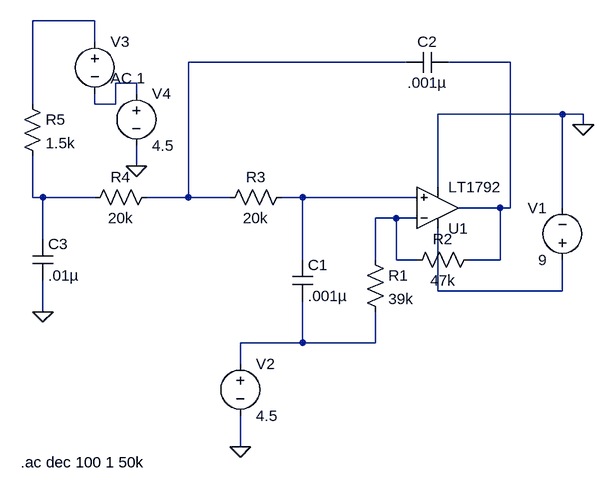
[diagram p0: schematic LPFmodified.asc]
LPFmodified.asc, the LTspice schematic file:
Version 4
SHEET 1 880 680
WIRE -368 -176 -464 -176
WIRE -368 -144 -368 -176
WIRE 112 -112 -224 -112
WIRE 272 -112 176 -112
WIRE -304 -80 -336 -80
WIRE -304 -64 -304 -80
WIRE -464 -48 -464 -176
WIRE -368 -48 -368 -64
WIRE -336 -48 -336 -80
WIRE -336 -48 -368 -48
WIRE 352 -32 160 -32
WIRE 384 -32 352 -32
WIRE 384 -16 384 -32
WIRE -304 48 -304 16
WIRE 160 80 160 -32
WIRE -464 96 -464 32
WIRE -448 96 -464 96
WIRE -416 96 -448 96
WIRE -368 96 -416 96
WIRE -224 96 -224 -112
WIRE -224 96 -288 96
WIRE -160 96 -224 96
WIRE -48 96 -80 96
WIRE 128 96 -48 96
WIRE 256 112 192 112
WIRE 272 112 272 -112
WIRE 272 112 256 112
WIRE 352 112 352 -32
WIRE 96 128 64 128
WIRE 128 128 96 128
WIRE -448 160 -448 96
WIRE -48 192 -48 96
WIRE 64 192 64 128
WIRE 96 192 96 128
WIRE 128 192 96 192
WIRE 256 192 256 112
WIRE 256 192 208 192
WIRE 160 240 160 144
WIRE 352 240 352 192
WIRE 352 240 160 240
WIRE -448 272 -448 224
WIRE -48 320 -48 256
WIRE -48 320 -144 320
WIRE 64 320 64 272
WIRE 64 320 -48 320
WIRE -144 352 -144 320
WIRE -144 480 -144 432
FLAG -448 272 0
FLAG -144 480 0
FLAG 384 -16 0
FLAG -304 48 0
DATAFLAG -416 96 ""
DATAFLAG -464 96 ""
SYMBOL voltage 352 208 R180
WINDOW 0 24 96 Left 2
WINDOW 3 24 16 Left 2
WINDOW 123 0 0 Left 2
WINDOW 39 0 0 Left 2
SYMATTR InstName V1
SYMATTR Value 9
SYMBOL voltage -144 336 R0
WINDOW 123 0 0 Left 2
WINDOW 39 0 0 Left 2
SYMATTR InstName V2
SYMATTR Value 4.5
SYMBOL res 48 176 R0
SYMATTR InstName R1
SYMATTR Value 39k
SYMBOL cap -64 192 R0
SYMATTR InstName C1
SYMATTR Value .001µ
SYMBOL cap 176 -128 R90
WINDOW 0 0 32 VBottom 2
WINDOW 3 32 32 VTop 2
SYMATTR InstName C2
SYMATTR Value .001µ
SYMBOL res 224 176 R90
WINDOW 0 0 56 VBottom 2
WINDOW 3 32 56 VTop 2
SYMATTR InstName R2
SYMATTR Value 47k
SYMBOL res -64 80 R90
WINDOW 0 0 56 VBottom 2
WINDOW 3 32 56 VTop 2
SYMATTR InstName R3
SYMATTR Value 20k
SYMBOL res -272 80 R90
WINDOW 0 0 56 VBottom 2
WINDOW 3 32 56 VTop 2
SYMATTR InstName R4
SYMATTR Value 20k
SYMBOL cap -464 160 R0
SYMATTR InstName C3
SYMATTR Value .01µ
SYMBOL res -480 -64 R0
SYMATTR InstName R5
SYMATTR Value 1.5k
SYMBOL voltage -368 -160 R0
WINDOW 3 24 44 Left 2
WINDOW 123 24 72 Left 2
WINDOW 39 0 0 Left 2
SYMATTR InstName V3
SYMATTR Value ""
SYMATTR Value2 AC 1
SYMBOL Opamps\\LT1792 160 176 M180
SYMATTR InstName U1
SYMBOL voltage -304 -80 R0
WINDOW 123 0 0 Left 2
WINDOW 39 0 0 Left 2
SYMATTR InstName V4
SYMATTR Value 4.5
TEXT -482 504 Left 2 !.ac dec 100 1 50k

The netlist it stands for:
* LPFmodified.asc
V1 N008 0 9
V2 N009 0 4.5
R1 N007 N009 39k
C1 N006 N009 .001µ
C2 N003 N002 .001µ
R2 N003 N007 47k
R3 N006 N002 20k
R4 N002 N005 20k
C3 N005 0 .01µ
R5 N001 N005 1.5k
V3 N001 N004 AC 1
XU1 N006 N007 N008 0 N003 LT1792  ; pins In+ In- V+ V- OUT
V4 N004 0 4.5
.ac dec 100 1 50k
.backanno
.end